# Altium schematic sheet G2Prj.SchDoc
size A4
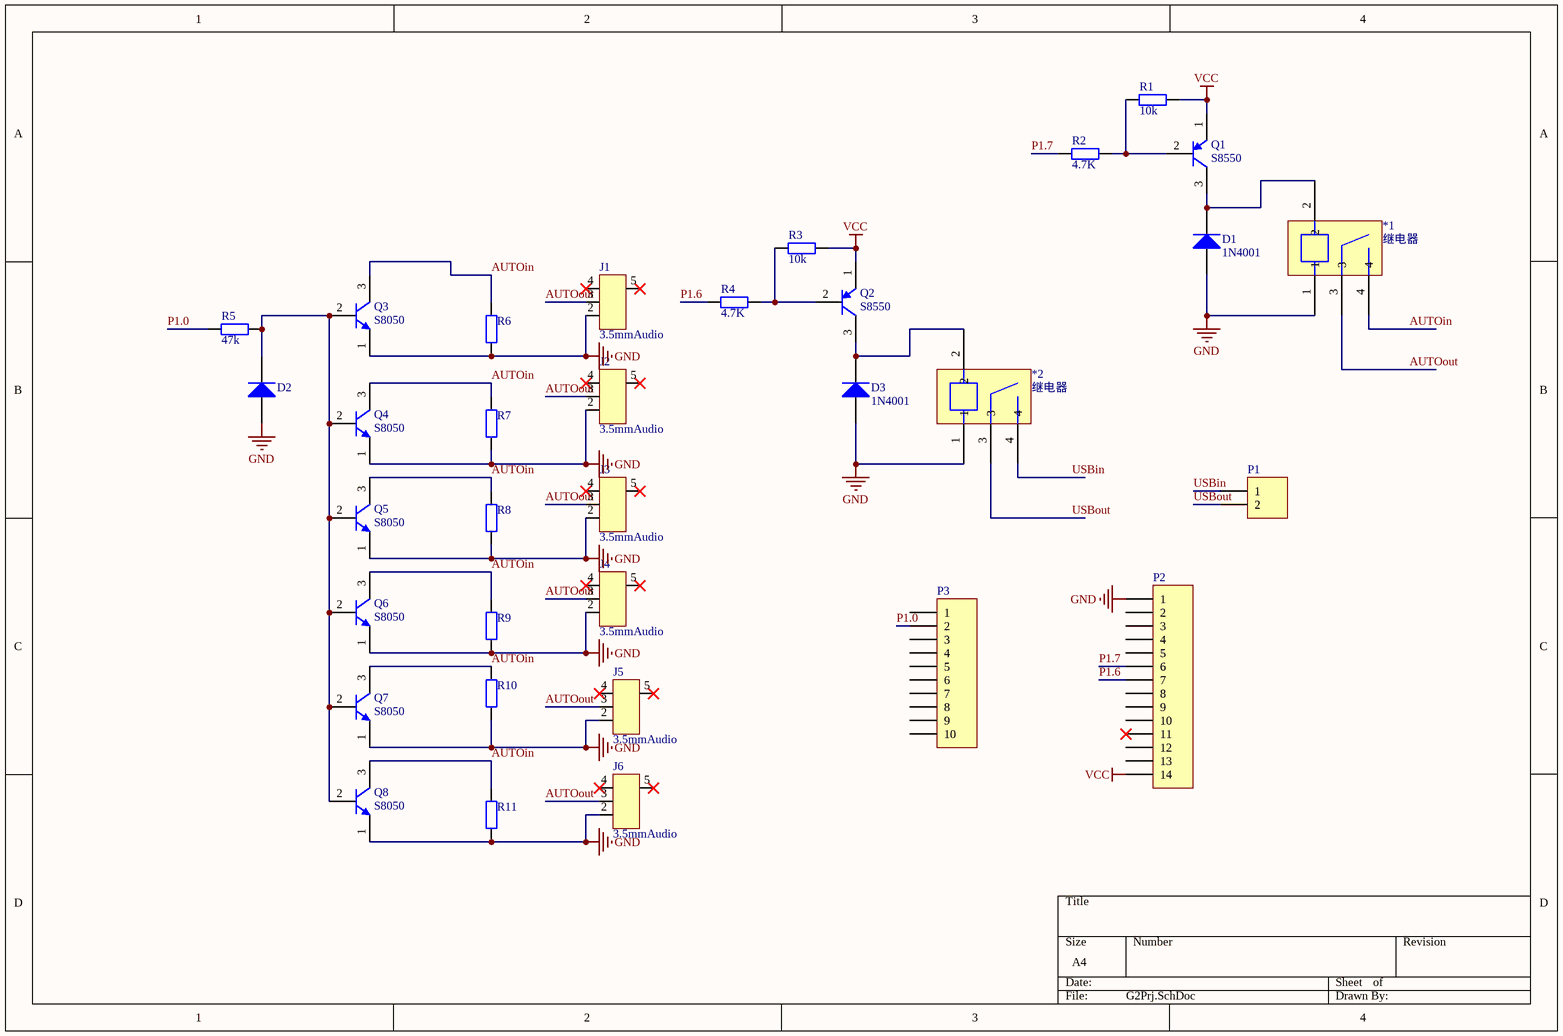
[diagram p0: G2Prj.SchDoc]

## Parts
*1  继电器  [PCBComponent_1]
*2  继电器  [PCBComponent_1]
D1  Type: 1N4001  [DIODE-1206]  (hidden comment: Diode)
D2  Diode  [DIODE-1206]  (value not drawn)
D3  Type: 1N4001  [DIODE-1206]  (hidden comment: Diode)
J1  3.5mmAudio  [Audio]
J2  3.5mmAudio  [Audio]
J3  3.5mmAudio  [Audio]
J4  3.5mmAudio  [Audio]
J5  3.5mmAudio  [Audio]
J6  3.5mmAudio  [Audio]
P1  Header 2  [HDR1X2]  (value not drawn)
P2  Header 14  [HDR1X14]  (value not drawn)
P3  Header 10  [HDR1X10]  (value not drawn)
Q1  S8550  [TO-92A]
Q2  S8550  [TO-92A]
Q3  S8050  [TO-92A]
Q4  S8050  [TO-92A]
Q5  S8050  [TO-92A]
Q6  S8050  [TO-92A]
Q7  S8050  [TO-92A]
Q8  S8050  [TO-92A]
R1  10k  [0805]
R2  4.7K  [0805]
R3  10k  [0805]
R4  4.7K  [0805]
R5  47k  [0805]
R6  2K  [0805]  (value not drawn)
R7  2K  [0805]  (value not drawn)
R8  2K  [0805]  (value not drawn)
R9  2K  [0805]  (value not drawn)
R10  2K  [0805]  (value not drawn)
R11  2K  [0805]  (value not drawn)

## Nets
GND: *1.1 *2.1 D1.1(A) D2.1(A) D3.1(A) J1.2 J2.2 J3.2 J4.2 J5.2 J6.2 P2.1 Q3.1(E) Q4.1(E) Q5.1(E) Q6.1(E) Q7.1(E) Q8.1(E) R6.1 R7.2 R8.1 R9.2 R10.1 R11.2
VCC: P2.14 Q1.1(E) Q2.1(E) R1.2 R3.2
AUTOin: *1.4 Q3.3(C) Q4.3(C) Q5.3(C) Q6.3(C) Q7.3(C) Q8.3(C) R6.2 R7.1 R8.2 R9.1 R10.2 R11.1
AUTOout: *1.3 J1.3 J2.3 J3.3 J4.3 J5.3 J6.3
P1.0: P3.2 R5.1
P1.6: P2.7 R4.1
P1.7: P2.6 R2.1
USBin: *2.4 P1.1
USBout: *2.3 P1.2
Net*1_2: *1.2 D1.2(K) Q1.3(C)
Net*2_2: *2.2 D3.2(K) Q2.3(C)
NetD2_2: D2.2(K) Q3.2(B) Q4.2(B) Q5.2(B) Q6.2(B) Q7.2(B) Q8.2(B) R5.2
NetQ1_2: Q1.2(B) R1.1 R2.2
NetQ2_2: Q2.2(B) R3.1 R4.2

Not connected (* = marked no-connect by the designer): J1 4(21)* 5(22)*; J2 4(21)* 5(22)*; J3 4(21)* 5(22)*; J4 4(21)* 5(22)*; J5 4(21)* 5(22)*; J6 4(21)* 5(22)*; P2 2 3 4 5 8 9 10 11* 12 13; P3 1 3 4 5 6 7 8 9 10

## Library data of the parts
*1 *2 = Component_1
D1 D3 = Diode: 二极管; Published: 8-Jun-2000; LatestRevisionDate: 17-Jul-2002; LatestRevisionNote: Re-released for DXP Platform.; PackageDocument: Sep-1996; PackageReference: SMC; Publisher: Altium Limited; Code_JEDEC: DO-214-AB
D2 = Diode: 二极管; Type: 1N4001; Published: 8-Jun-2000; LatestRevisionDate: 17-Jul-2002; LatestRevisionNote: Re-released for DXP Platform.; PackageDocument: Sep-1996; PackageReference: SMC; Publisher: Altium Limited; Code_JEDEC: DO-214-AB
P1 = Header 2: Header, 2-Pin; LatestRevisionDate: 17-Jul-2002; LatestRevisionNote: Re-released for DXP Platform.; Publisher: Altium Limited
P2 = Header 14: Header, 14-Pin; LatestRevisionDate: 17-Jul-2002; LatestRevisionNote: Re-released for DXP Platform.; Publisher: Altium Limited
P3 = Header 10: Header, 10-Pin; LatestRevisionDate: 17-Jul-2002; LatestRevisionNote: Re-released for DXP Platform.; Publisher: Altium Limited
Q1 Q2 = S8550: PNP三极管; Published: 8-Jun-2000; LatestRevisionDate: 15-Jan-2003; LatestRevisionNote: PCB Footprint 'BCY-W3/D4.7' replaced; DatasheetDocument: 1997; PackageDocument: Sep-1998; PackageReference: TO-92A; Publisher: Altium Limited; Code_JEDEC: TO-92A; ComponentLink1Description: Manufacturer Link; ComponentLink1URL: http://www.fairchildsemi.com/; ComponentLink2Description: Datasheet; ComponentLink2URL: http://www.fairchildsemi.com/ds/2N%2F2N3906.pdf
Q3-Q8 = S8050: NPN三极管; Published: 8-Jun-2000; LatestRevisionDate: 15-Jan-2003; LatestRevisionNote: PCB Footprint 'BCY-W3/D4.7' replaced; DatasheetDocument: 1997; PackageDocument: Sep-1998; PackageReference: TO-92A; Publisher: Altium Limited; Code_JEDEC: TO-92A; ComponentLink1Description: Manufacturer Link; ComponentLink1URL: http://www.fairchildsemi.com/; ComponentLink2Description: Datasheet; ComponentLink2URL: http://www.fairchildsemi.com/ds/2N%2F2N3904.pdf
R1-R11 = RES: Resistor